# EAGLE schematic stereo_mix_front (EAGLE 9.5.2)

## Sheet 1 of 2: Channels
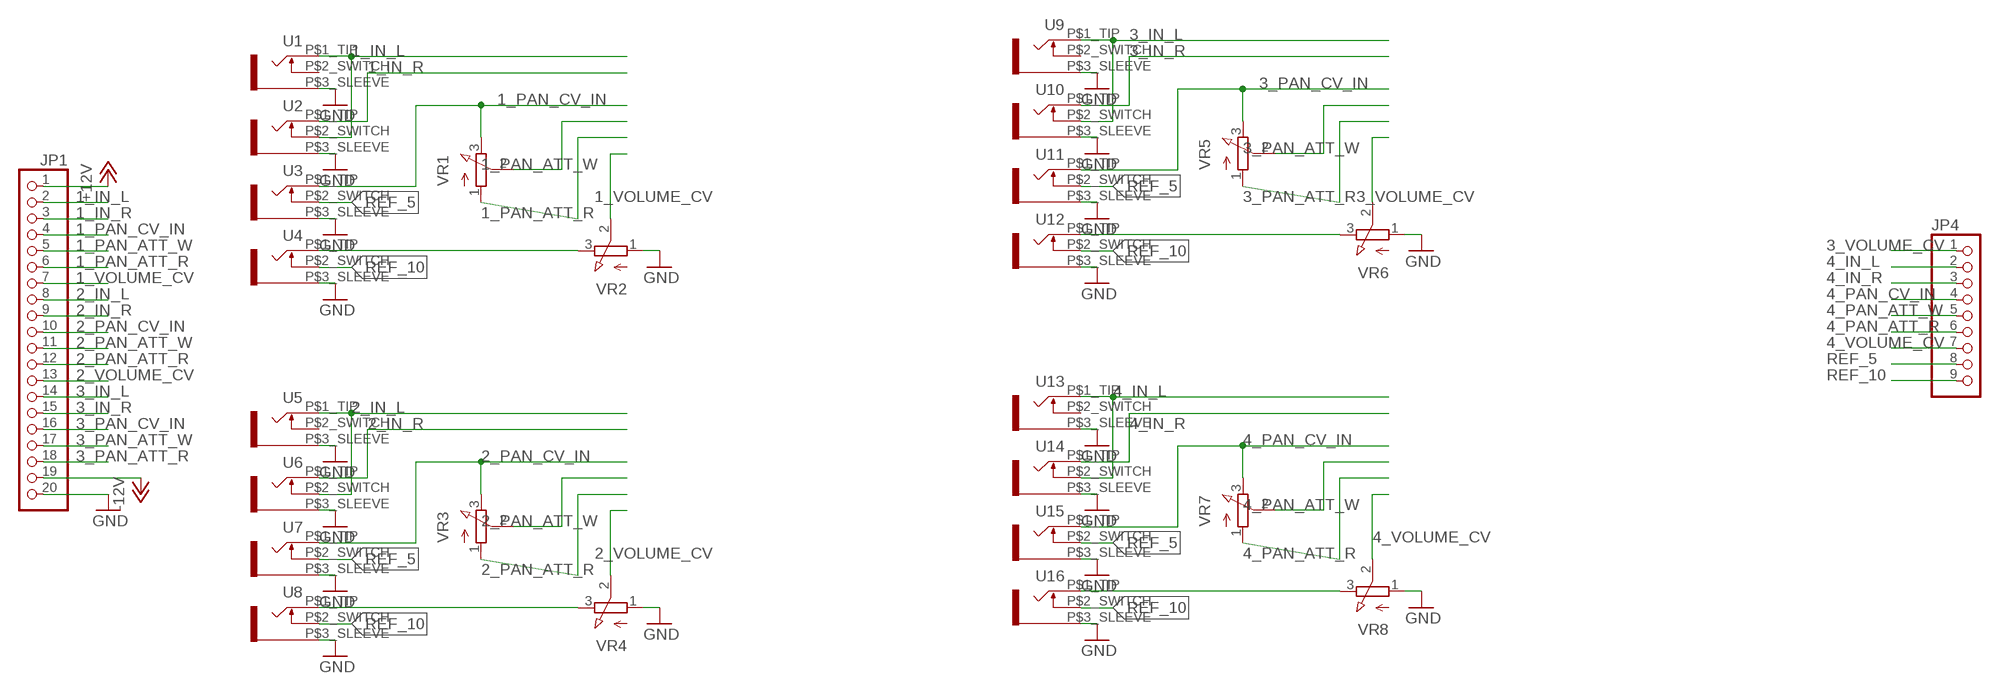
[diagram p0: schematic, sheet 1]

### Parts
JP1  PINHD-1X20  [1X20]
JP4  PINHD-1X9  [1X09]
U1  WQP-PJ301M-12_JACK  [WQP-PJ301M-12_JACK]
U2  WQP-PJ301M-12_JACK  [WQP-PJ301M-12_JACK]
U3  WQP-PJ301M-12_JACK  [WQP-PJ301M-12_JACK]
U4  WQP-PJ301M-12_JACK  [WQP-PJ301M-12_JACK]
U5  WQP-PJ301M-12_JACK  [WQP-PJ301M-12_JACK]
U6  WQP-PJ301M-12_JACK  [WQP-PJ301M-12_JACK]
U7  WQP-PJ301M-12_JACK  [WQP-PJ301M-12_JACK]
U8  WQP-PJ301M-12_JACK  [WQP-PJ301M-12_JACK]
U9  WQP-PJ301M-12_JACK  [WQP-PJ301M-12_JACK]
U10  WQP-PJ301M-12_JACK  [WQP-PJ301M-12_JACK]
U11  WQP-PJ301M-12_JACK  [WQP-PJ301M-12_JACK]
U12  WQP-PJ301M-12_JACK  [WQP-PJ301M-12_JACK]
U13  WQP-PJ301M-12_JACK  [WQP-PJ301M-12_JACK]
U14  WQP-PJ301M-12_JACK  [WQP-PJ301M-12_JACK]
U15  WQP-PJ301M-12_JACK  [WQP-PJ301M-12_JACK]
U16  WQP-PJ301M-12_JACK  [WQP-PJ301M-12_JACK]
VR1  9MM_SNAP-IN_POT_  [9MM_SNAP-IN_POT]
VR2  9MM_SNAP-IN_POT_  [9MM_SNAP-IN_POT]
VR3  9MM_SNAP-IN_POT_  [9MM_SNAP-IN_POT]
VR4  9MM_SNAP-IN_POT_  [9MM_SNAP-IN_POT]
VR5  9MM_SNAP-IN_POT_  [9MM_SNAP-IN_POT]
VR6  9MM_SNAP-IN_POT_  [9MM_SNAP-IN_POT]
VR7  9MM_SNAP-IN_POT_  [9MM_SNAP-IN_POT]
VR8  9MM_SNAP-IN_POT_  [9MM_SNAP-IN_POT]

### Nets
1_IN_L: JP1.2 U1.P$1_TIP U2.P$2_SWITCH
1_IN_R: JP1.3 U2.P$1_TIP
1_PAN_ATT_R: JP1.6 VR1.1(A)
1_PAN_ATT_W: JP1.5 VR1.2(S)
1_PAN_CV_IN: JP1.4 U3.P$1_TIP VR1.3(E)
1_VOLUME_CV: JP1.7 VR2.2(S)
2_IN_L: JP1.8 U5.P$1_TIP U6.P$2_SWITCH
2_IN_R: JP1.9 U6.P$1_TIP
2_PAN_ATT_R: JP1.12 VR3.1(A)
2_PAN_ATT_W: JP1.11 VR3.2(S)
2_PAN_CV_IN: JP1.10 U7.P$1_TIP VR3.3(E)
2_VOLUME_CV: JP1.13 VR4.2(S)
3_IN_L: JP1.14 U9.P$1_TIP U10.P$2_SWITCH
3_IN_R: JP1.15 U10.P$1_TIP
3_PAN_ATT_R: JP1.18 VR5.1(A)
3_PAN_ATT_W: JP1.17 VR5.2(S)
3_PAN_CV_IN: JP1.16 U11.P$1_TIP VR5.3(E)
3_VOLUME_CV: JP4.1 VR6.2(S)
4_IN_L: JP4.2 U13.P$1_TIP U14.P$2_SWITCH
4_IN_R: JP4.3 U14.P$1_TIP
4_PAN_ATT_R: JP4.6 VR7.1(A)
4_PAN_ATT_W: JP4.5 VR7.2(S)
4_PAN_CV_IN: JP4.4 U15.P$1_TIP VR7.3(E)
4_VOLUME_CV: JP4.7 VR8.2(S)
+12V: JP1.1
-12V: JP1.19
GND: JP1.20 U1.P$3_SLEEVE U2.P$3_SLEEVE U3.P$3_SLEEVE U4.P$3_SLEEVE U5.P$3_SLEEVE U6.P$3_SLEEVE U7.P$3_SLEEVE U8.P$3_SLEEVE U9.P$3_SLEEVE U10.P$3_SLEEVE U11.P$3_SLEEVE U12.P$3_SLEEVE U13.P$3_SLEEVE U14.P$3_SLEEVE U15.P$3_SLEEVE U16.P$3_SLEEVE VR2.1(A) VR4.1(A) VR6.1(A) VR8.1(A) ; also sheet 2
N$13: U8.P$1_TIP VR4.3(E)
N$17: U4.P$1_TIP VR2.3(E)
N$21: U12.P$1_TIP VR6.3(E)
N$28: U16.P$1_TIP VR8.3(E)
REF_5: JP4.8 U3.P$2_SWITCH U7.P$2_SWITCH U11.P$2_SWITCH U15.P$2_SWITCH
REF_10: JP4.9 U4.P$2_SWITCH U8.P$2_SWITCH U12.P$2_SWITCH U16.P$2_SWITCH
Unconnected: U1.P$2_SWITCH U5.P$2_SWITCH U9.P$2_SWITCH U13.P$2_SWITCH

## Sheet 2 of 2: Output
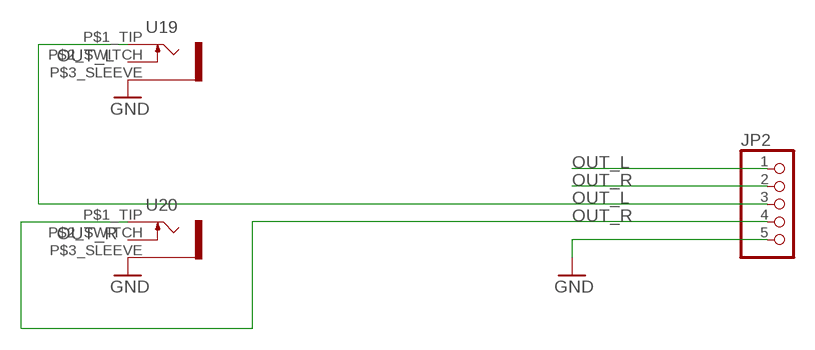
[diagram p1: schematic, sheet 2]

### Parts
JP2  PINHD-1X5  [1X05]
U19  WQP-PJ301M-12_JACK  [WQP-PJ301M-12_JACK]
U20  WQP-PJ301M-12_JACK  [WQP-PJ301M-12_JACK]

### Nets
GND: JP2.5 U19.P$3_SLEEVE U20.P$3_SLEEVE ; also sheet 1
OUT_L: JP2.1 JP2.3 U19.P$1_TIP
OUT_R: JP2.2 JP2.4 U20.P$1_TIP
Unconnected: U19.P$2_SWITCH U20.P$2_SWITCH

## Library data of the parts
JP1 = pinhead:PINHD-1X20: PIN HEADER
JP2 = pinhead:PINHD-1X5: PIN HEADER
JP4 = pinhead:PINHD-1X9: PIN HEADER
U1-U16 U19 U20 = jhbruhn-physical:WQP-PJ301M-12_JACK
VR1-VR8 = jhbruhn-physical:9MM_SNAP-IN_POT: 9mm vertical snap-in pot, Alpha / Panasonic style; SPICEPREFIX: J